# EAGLE design Androspeed (EAGLE 5.11)
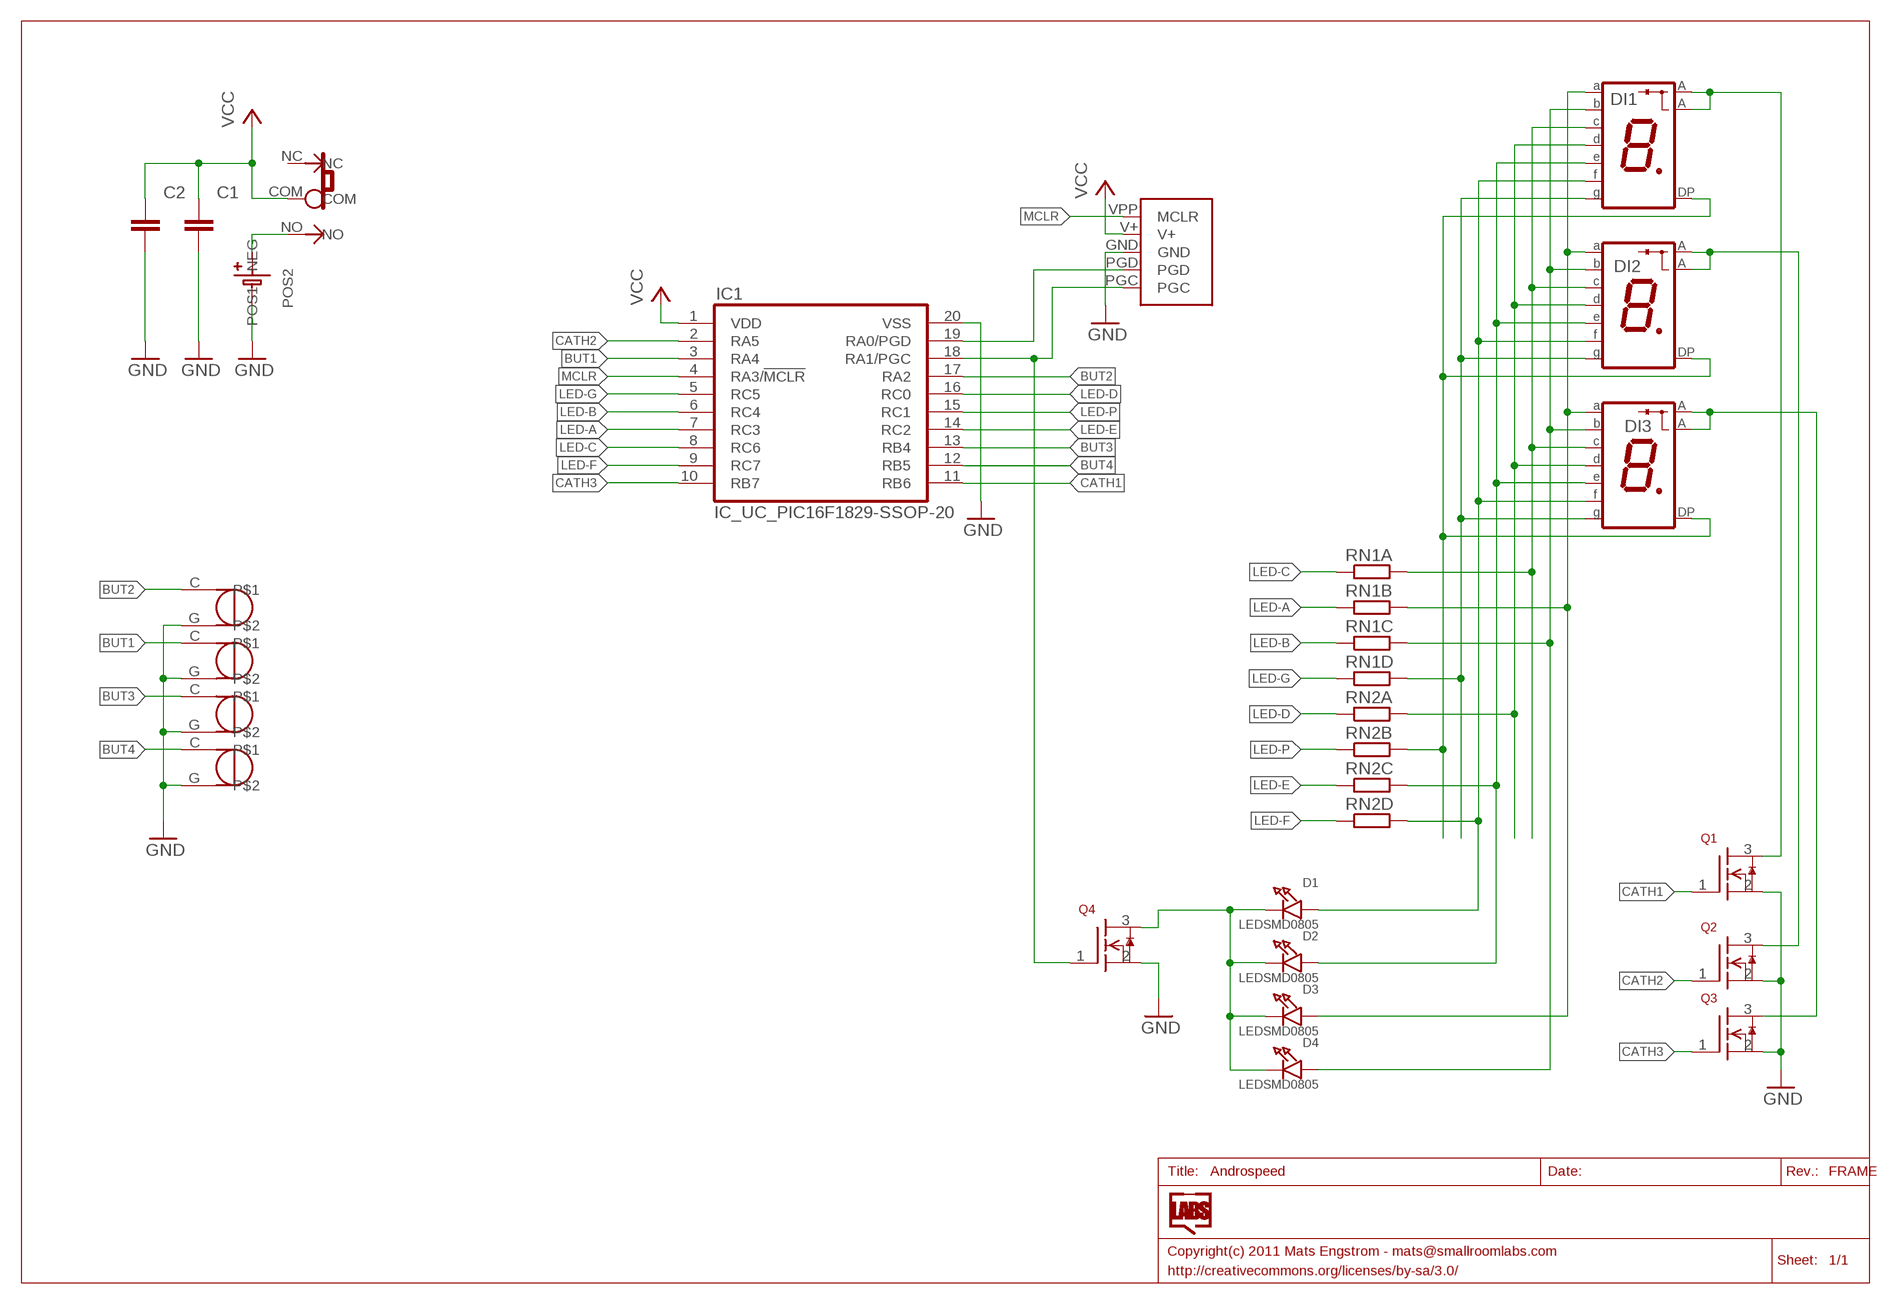
[diagram p0: schematic, sheet 1]

## Parts
B1  TOUCH2-5D1  [TOUCH-CAP-5D1]
B2  TOUCH2-5D1  [TOUCH-CAP-5D1]
B3  TOUCH2-5D1  [TOUCH-CAP-5D1]
B4  TOUCH2-5D1  [TOUCH-CAP-5D1]
C1  CAPACITOR_NPOL-0805  [C805]
C2  CAPACITOR_NPOL-1206  [C1206]
CN1  ICSPPAD  [ICSP-PAD]
D1  LEDSMD0805  [CHIPLED_0805]
D2  LEDSMD0805  [CHIPLED_0805]
D3  LEDSMD0805  [CHIPLED_0805]
D4  LEDSMD0805  [CHIPLED_0805]
DI1  7SEG-CA0.39  [LG3911]
DI2  7SEG-CA0.39  [LG3911]
DI3  7SEG-CA0.39  [LG3911]
IC1  IC_UC_PIC16F1829-SSOP-20  [SSOP-20]
Q1  N-MOSFET-STD  [SOT23]
Q2  N-MOSFET-STD  [SOT23]
Q3  N-MOSFET-STD  [SOT23]
Q4  N-MOSFET-STD  [SOT23]
RN1  RESISTOR_ARRAY_4  [RN8P-4R-CRA06S]
RN2  RESISTOR_ARRAY_4  [RN8P-4R-CRA06S]
SW1  SLIDESWITCH-PCM12  [PCM12]
U$3  BATTERY-SMALLPADS  [CR2032-PTH-CHEAP-SMALLPADS]

## Nets
ANODE-A: D3.A DI1.P$10(A) DI2.P$10(A) DI3.P$10(A) RN1.7
ANODE-B: D4.A DI1.P$9(B) DI2.P$9(B) DI3.P$9(B) RN1.6
ANODE-C: DI1.P$7(C) DI2.P$7(C) DI3.P$7(C) RN1.8
ANODE-D: DI1.P$5(D) DI2.P$5(D) DI3.P$5(D) RN2.8
ANODE-E: D2.A DI1.P$2(E) DI2.P$2(E) DI3.P$2(E) RN2.6
ANODE-F: D1.A DI1.P$1(F) DI2.P$1(F) DI3.P$1(F) RN2.5
ANODE-G: DI1.P$6(G) DI2.P$6(G) DI3.P$6(G) RN1.5
ANODE-P: DI1.P$4(DP) DI2.P$4(DP) DI3.P$4(DP) RN2.7
BUT1: B2.C IC1.3(RA4)
BUT2: B1.C IC1.17(RA2)
BUT3: B3.C IC1.13(RB4)
BUT4: B4.C IC1.12(RB5)
CATH1: IC1.11(RB6) Q1.1(G)
CATH2: IC1.2(RA5) Q2.1(G)
CATH3: IC1.10(RB7) Q3.1(G)
GND: B1.G B2.G B3.G B4.G C1.2 C2.2 CN1.GND IC1.20(VSS) Q1.2(S) Q2.2(S) Q3.2(S) Q4.2(S) U$3.NEG
LED-A: IC1.7(RC3) RN1.2
LED-B: IC1.6(RC4) RN1.3
LED-C: IC1.8(RC6) RN1.1
LED-D: IC1.16(RC0) RN2.1
LED-E: IC1.14(RC2) RN2.3
LED-F: IC1.9(RC7) RN2.4
LED-G: IC1.5(RC5) RN1.4
LED-P: IC1.15(RC1) RN2.2
MCLR: CN1.VPP(MCLR) IC1.4(RA3/!MCLR)
N$1: CN1.PGD IC1.19(RA0/PGD)
N$2: CN1.PGC IC1.18(RA1/PGC) Q4.1(G)
N$4: D1.C D2.C D3.C D4.C Q4.3(D)
N$7: SW1.NO U$3.POS@1(POS1)
N$17: DI3.P$3(A) DI3.P$8(A) Q3.3(D)
N$18: DI2.P$3(A) DI2.P$8(A) Q2.3(D)
N$19: DI1.P$3(A) DI1.P$8(A) Q1.3(D)
VCC: C1.1 C2.1 CN1.V+ IC1.1(VDD) SW1.COM
Unconnected: SW1.NC

## Power pins joined to a net without a drawn wire
POS2: U$3.POS@3(POS2)

## Library data of the parts
B1-B4 = SmallRoomLabs:TOUCH2
C1 C2 = dp_devices:CAPACITOR_NPOL: Non-Polarized capacitor in various packages
CN1 = SmallRoomLabs:ICSP
D1-D4 = SmallRoomLabs:LED
DI1-DI3 = SmallRoomLabs:7SEG-CA
IC1 = dp_devices:IC_UC_PIC16F1829
Q1-Q4 = SmallRoomLabs:N-MOSFET
RN1 RN2 = dp_devices:RESISTOR_ARRAY_4: 4 Resistor Array 0603
SW1 = SmallRoomLabs:SLIDESWITCH
U$3 = SmallRoomLabs:BATTERY: A23 Farnell/E14 908721

## Board
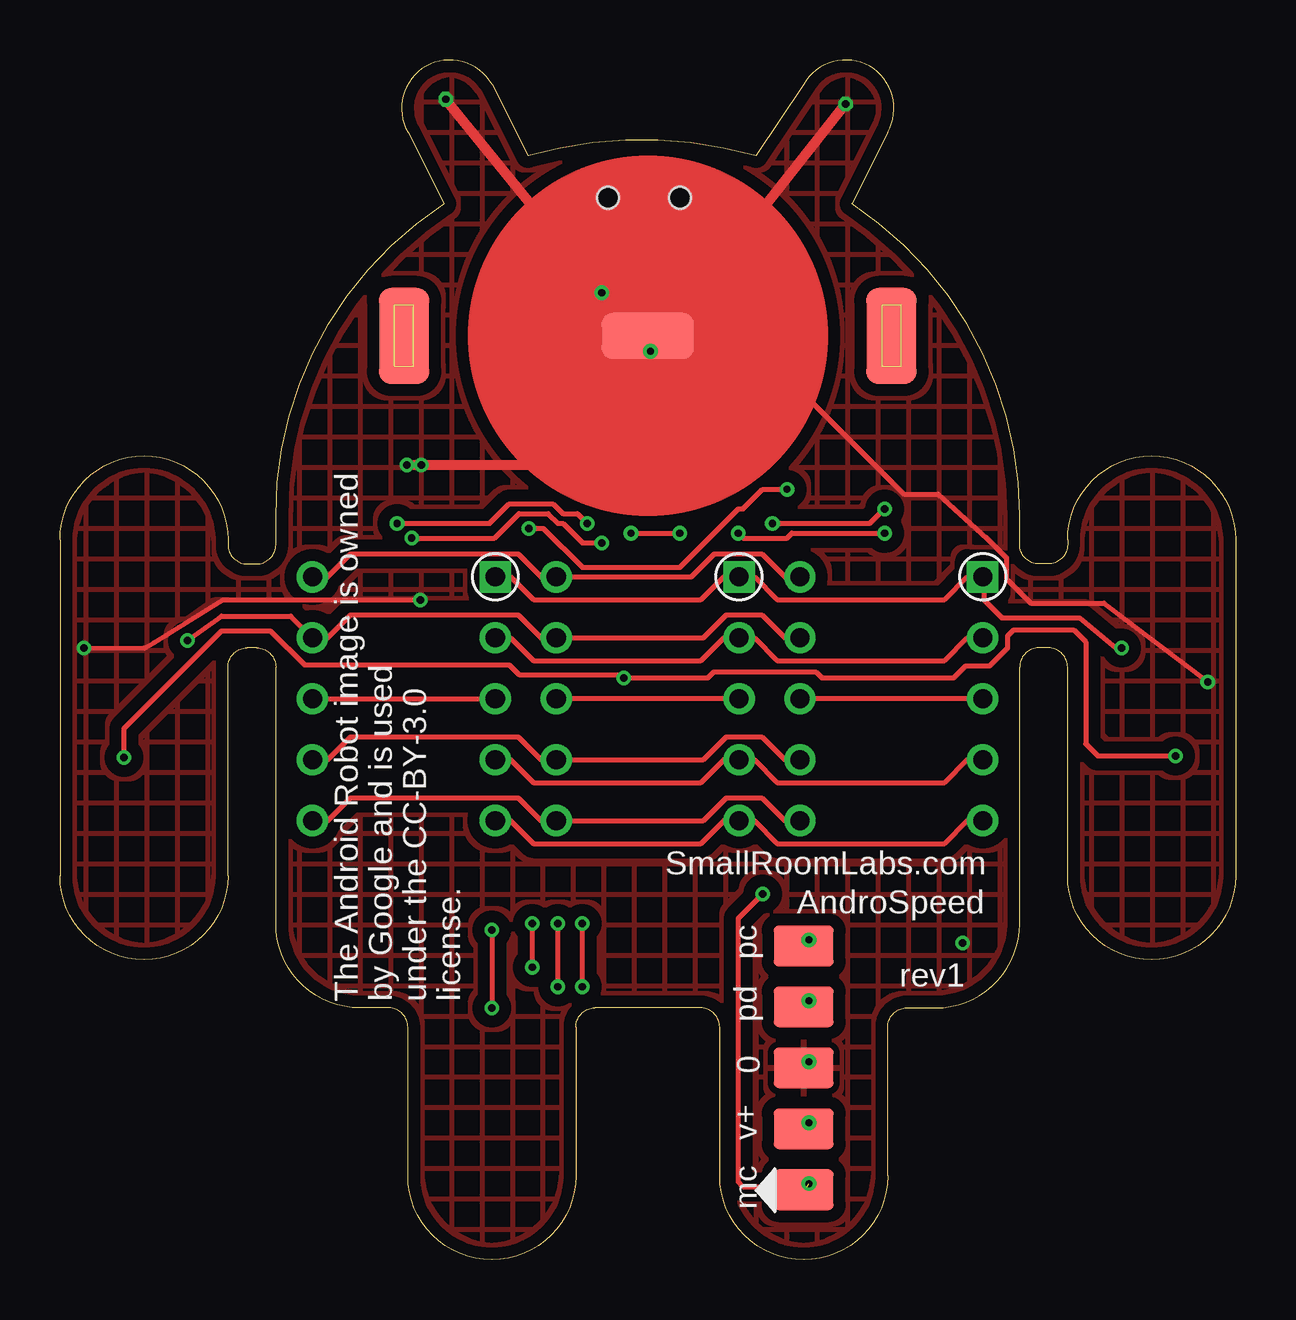
[diagram p1: board, top side]
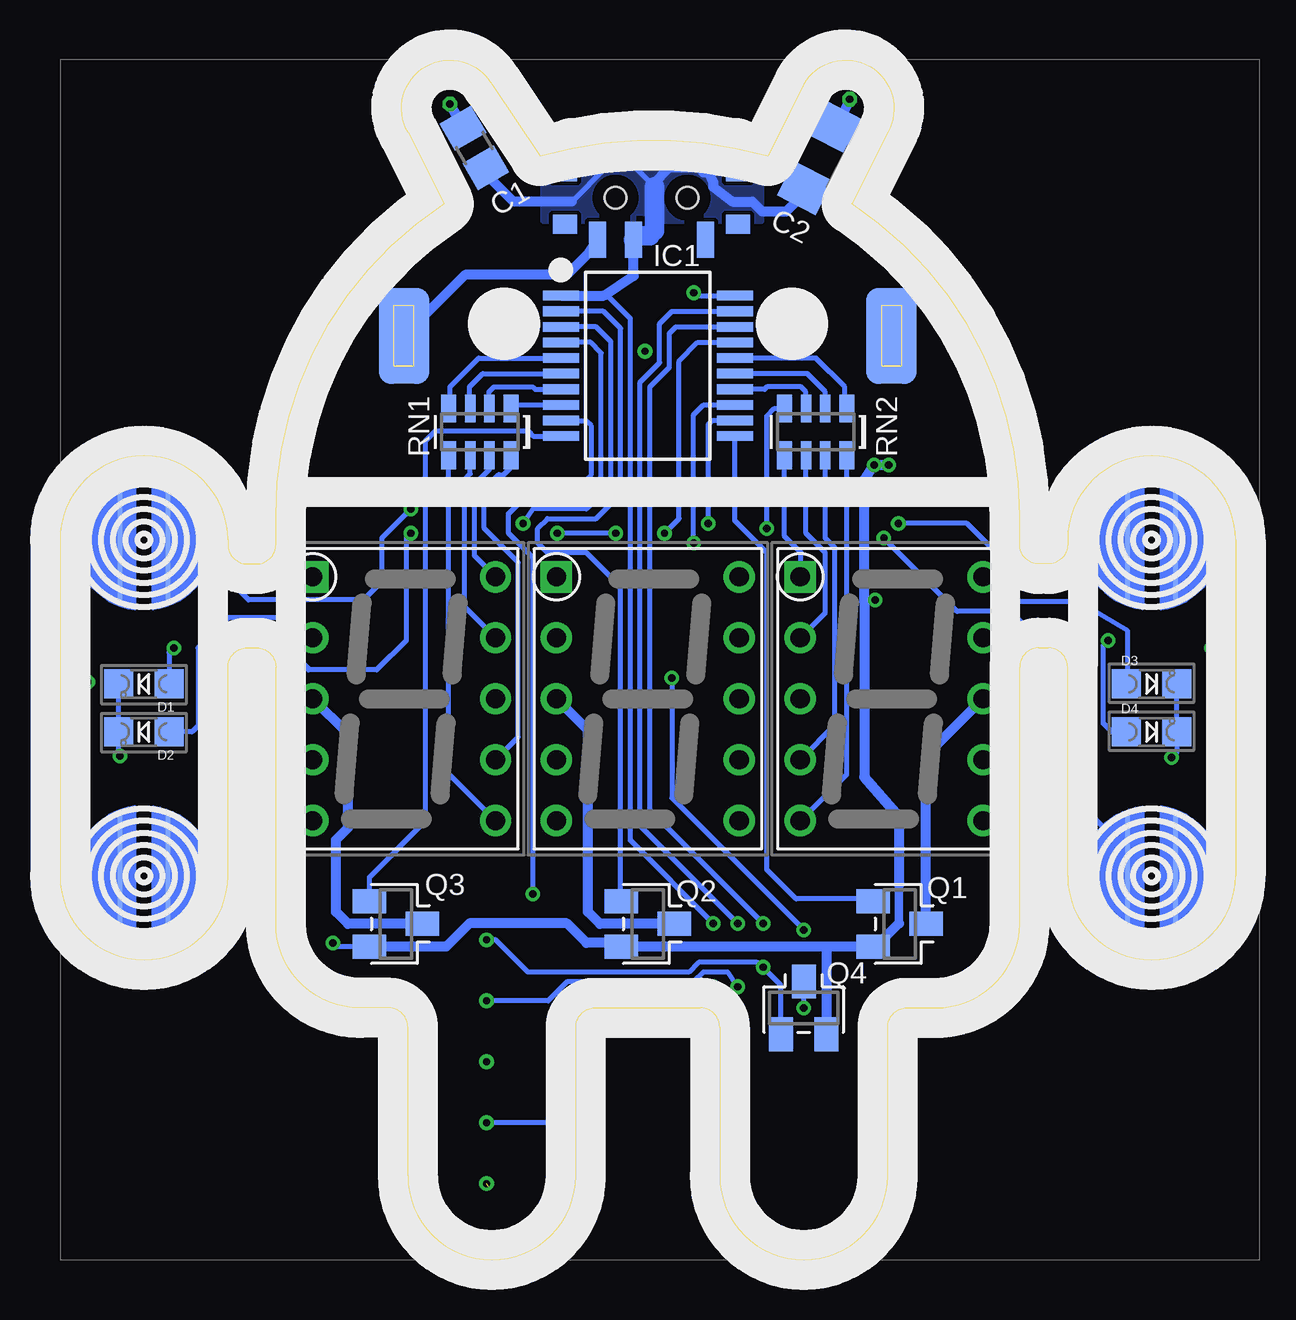
[diagram p2: board, bottom side, seen from below]

Size 49 x 49.99 mm. Coordinates in mm from the lower left corner, seen from the top.
Copper layers (1*16): Top 0.035mm / dielectric 1.5mm / Bottom 0.035mm
Design rules "SmartPrototyping": minimum track width 7mil, minimum drill 12mil, track to track 7mil, track to pad 7mil, pad to pad 7mil, via to via 7mil, smd to smd 0mil, copper to edge 20mil, drill to drill 10mil, minimum pad ring 10mil, minimum via ring 6mil, stop-mask expansion 2mil, vias tented up to drill 25mil, thermal gap 10mil

### Footprints (pad centres in the part's own frame; a part is rotated, then mirrored left to right if it is on the bottom)
TOUCH-CAP-5D1 = smd 0.203 x 5: C -1,0; G 1,0
C805 = smd 1.3 x 1.5: 1 -0.95,0; 2 0.95,0
C1206 = smd 1.6 x 1.803: 1 -1.422,0; 2 1.422,0
ICSP-PAD = smd 1.7 x 2.5: GND 0,0; PGC 5.08,0; PGD 2.54,0; V+ -2.54,0; VPP -5.08,0
CHIPLED_0805 = smd 1.2 x 1.2: A 0,-1.05; C 0,1.05
LG3911 = drill 0.8 square: P$1 -3.81,5.08 | drill 0.8 round: P$2 -3.81,2.54; P$3 -3.81,0; P$4 -3.81,-2.54; P$5 -3.81,-5.08; P$6 3.81,-5.08; P$7 3.81,-2.54; P$8 3.81,0; P$9 3.81,2.54; P$10 3.81,5.08
SSOP-20 = smd 0.4 x 1.5: 1 -2.925,-3.625; 2 -2.275,-3.625; 3 -1.625,-3.625; 4 -0.975,-3.625; 5 -0.325,-3.625; 6 0.325,-3.625; 7 0.975,-3.625; 8 1.625,-3.625; 9 2.275,-3.625; 10 2.925,-3.625; 11 2.925,3.625; 12 2.275,3.625; 13 1.625,3.625; 14 0.975,3.625; 15 0.325,3.625; 16 -0.325,3.625; 17 -0.975,3.625; 18 -1.625,3.625; 19 -2.275,3.625; 20 -2.925,3.625
SOT23 = smd 1 x 1.4: 1 -0.95,-1.1; 2 0.95,-1.1; 3 0,1.1
RN8P-4R-CRA06S = smd 0.63 x 1.15: 1 -1.295,-0.975; 4 1.295,-0.975; 5 1.295,0.975; 8 -1.295,0.975 | smd 0.44 x 1.15: 2 -0.4,-0.975; 3 0.4,-0.975; 6 0.4,0.975; 7 -0.4,0.975
PCM12 = smd 0.7 x 1.5: COM 0.75,1.75; NC -2.25,1.75; NO 2.25,1.75 | smd 1 x 0.8: P$1 -3.6,-1.1; P$2 -3.6,1.1; P$3 3.6,1.1; P$4 3.6,-1.1 | hole 0.9: -1.5,0; 1.5,0
CR2032-PTH-CHEAP-SMALLPADS = smd 3.81 x 1.905: NEG 0,0 | smd 2.1 x 4 bottom: POS@1 -10.16,0; POS@4 10.16,0 | smd 2.1 x 4: POS@2 -10.16,0; POS@3 10.16,0

### Placement (x,y rotation side)
B1  45.5,16 180 bottom
B2  45.5,30 180 bottom
B3  3.5,16 0 bottom
B4  3.5,30 0 bottom
C1  31.73,46.33 120 bottom
C2  17.3,45.92 63 bottom
CN1  31,8 90 top
D1  45.5,24 90 bottom
D2  45.5,22 90 bottom
D3  3.5,24 270 bottom
D4  3.5,22 270 bottom
DI1  14.34,23.38 0 bottom
DI2  24.5,23.38 0 bottom
DI3  34.66,23.38 0 bottom
IC1  24.5,37.25 270 bottom
Q1  14,14 270 bottom
Q2  24.5,14 270 bottom
Q3  35,14 270 bottom
Q4  18,10.5 0 bottom
RN1  31.5,34.5 180 bottom
RN2  17.5,34.5 180 bottom
SW1  24.34,44.25 180 bottom
U$2  [ANDROID_OUTLINE_5]  49,0 0 bottom
U$3  24.5,38.5 180 top

### Tracks (layer width: path | path; a pad name or v marks a point on that pad's centre or on a via)
ANODE-A
  Top 0.203: DI3.P$10 30.21,28.46 29.26,29.41 27.27,29.41 26.32,28.46 DI2.P$10 20.05,28.46 19.1,29.41 12.11,29.41 11.16,28.46 DI1.P$10
  Bottom 0.203: RN1.7 31.1,32.94 31.73,32.31 31.73,29.34 DI3.P$10 | DI1.P$10 10,28.46 8.97,27.43 6.53,27.43 4.5,26.21 4.5,24.05 D3.A
ANODE-B  (via drill 0.3)
  Top 0.203: DI3.P$9 30.21,25.92 29.26,26.87 27.77,26.87 26.82,25.92 DI2.P$9 20.05,25.92 19.1,26.87 12.11,26.87 11.16,25.92 DI1.P$9 9.62,26.82 6.73,26.82 v5.31,25.81
  Bottom 0.203: RN1.6 31.9,32.75 32.13,32.51 32.13,27.21 DI3.P$9 | D4.A 5.16,22 5.52,22.35 5.52,25.6 v5.31,25.81
ANODE-C
  Top 0.203: DI3.P$7 30.21,20.84 29.26,21.79 27.77,21.79 26.82,20.84 DI2.P$7 20.05,20.84 19.1,21.79 12.11,21.79 11.16,20.84 DI1.P$7
  Bottom 0.203: DI3.P$7 29.9,21.79 29.9,29.06 31.32,30.48 31.32,32.11 30.71,32.72 30.51,32.72 30.2,33.02 RN1.8
ANODE-D
  Top 0.203: DI3.P$5 37.83,18.3 36.88,17.35 29.89,17.35 28.94,18.3 DI2.P$5 27.67,18.3 26.72,17.35 19.73,17.35 18.78,18.3 DI1.P$5
  Bottom 0.203: RN2.8 16.2,20.24 DI1.P$5
ANODE-E
  Top 0.203: DI3.P$2 37.83,25.92 36.88,24.97 29.89,24.97 28.94,25.92 DI2.P$2 27.67,25.92 26.72,24.97 19.73,24.97 18.78,25.92 DI1.P$2
  Bottom 0.203: RN2.6 17.9,30.27 17.1,29.46 17.1,26.97 DI1.P$2 | D2.A 43.5,22 43.25,22.25 43.25,25.5 42,26.75 39.29,26.75 DI3.P$2
ANODE-F  (via drill 0.3)
  Top 0.203: DI1.P$1 18.78,28.46 19.73,27.51 26.72,27.51 27.67,28.46 DI2.P$1 28.94,28.46 29.89,27.51 36.88,27.51 37.83,28.46 DI3.P$1 38.5,28.43 38.5,27.5 39.25,26.75 42.5,26.75 44,25.5 v44.25,25.5
  Bottom 0.203: RN2.5 18.79,30.14 18.11,29.46 18.11,28.49 DI1.P$1 | D1.A 44.45,25.3 v44.25,25.5
ANODE-G
  Top 0.203: DI3.P$6 30.21,18.3 29.26,19.25 27.77,19.25 26.82,18.3 DI2.P$6 20.05,18.3 19.1,19.25 12.11,19.25 11.16,18.3 DI1.P$6
  Bottom 0.203: RN1.5 32.79,20.25 DI3.P$6
ANODE-P
  Top 0.203: DI3.P$4 37.83,20.84 36.88,19.89 29.89,19.89 28.94,20.84 DI2.P$4 27.67,20.84 26.72,19.89 19.73,19.89 18.78,20.84 DI1.P$4
  Bottom 0.203: RN2.7 17.1,30.08 16.69,29.67 16.69,22.29 DI1.P$4
BUT1  (via drill 0.3)
  Top 0.203: v29.7,30.68 33.76,30.68 v34.37,31.29
  Bottom 0.203: IC1.3 26.65,38.88 26.04,38.26 26.04,32.31 27.05,31.29 29.29,31.29 v29.7,30.68 | B2.C 43.64,30 41.14,27.5 36.33,27.5 35.59,28.25 35.59,30.07 v34.37,31.29
BUT2  (via drill 0.3)
  Top 0.203: v23.8,30.28 v25.84,30.28 | v34.37,30.28 30.51,30.28 30.31,30.07 28.48,30.07 v28.27,30.28
  Bottom 0.203: IC1.17 22.42,38.23 23.19,37.45 23.19,30.89 v23.8,30.28 | B1.C 42.75,18.25 42.75,25.26 41.76,26.25 40.25,26.25 38.64,24.64 38.64,24.59 35.79,24.59 34.57,25.81 34.57,30.07 v34.37,30.28 | v25.84,30.28 v28.27,30.28
BUT3  (via drill 0.3)
  Top 0.203: v14.66,30.07 18.11,30.07 19.13,31.09 20.35,31.09 20.76,30.68 20.96,30.68 21.77,29.87 v22.58,29.87
  Bottom 0.203: IC1.13 22.18,35.62 22.58,35.22 v22.58,29.87 | B3.C 4.5,17 6.25,18.75 6.25,25.73 6.73,26.21 8.56,26.21 9.38,27.03 11.61,27.03 v14.66,30.07
BUT4  (via drill 0.3)
  Top 0.203: v14.05,30.68 17.91,30.68 18.72,31.5 20.55,31.5 20.96,31.09 21.57,31.09 v21.97,30.68
  Bottom 0.203: IC1.12 21.81,34.98 21.97,34.81 v21.97,30.68 | B4.C 4.57,30 6.33,28.25 8.77,28.25 11.2,30.68 v14.05,30.68
CATH1
  Bottom 0.203: IC1.11 20.87,30.8 19.54,29.46 19.54,16.26 18.32,15.04 15.19,15.04 Q1.1
CATH2
  Bottom 0.203: IC1.2 26.35,39.52 25.63,38.81 25.63,31.9 26.65,30.89 28.68,30.89 29.09,30.48 29.09,29.87 28.68,29.46 27.05,29.46 25.63,28.04 25.63,14.98 Q2.1
CATH3
  Bottom 0.203: IC1.10 29.27,34.33 29.49,34.54 33.35,34.54 33.76,34.14 33.76,18.29 36.1,15.95 Q3.1
GND  (via drill 0.3)
  Top 0.203: v47.85,24.08 43.51,27.37 40.47,27.37 39.45,28.39 39.45,29.26 38.64,30.07 36.6,31.9 35.18,31.9 28.48,38.61 v24.62,37.86 U$3.NEG 22.91,40.09 v22.58,40.3 | v15.02,27.5 6.8,27.5 3.89,25.7 3.51,25.49 v1,25.5
  Top 0.406: v14.46,33.12 20.15,33.12 v24.62,37.86 | v24.62,37.86 v16.08,48.36 | v24.62,37.86 v32.74,48.16
  Bottom 0.203: B3.G 2.5,16.5 1,18 v1,25.5 1,28 B4.G | B1.G 46.5,16.5 48,18 48,24.18 | 48,24.18 48,28 B2.G | IC1.20 22.3,40.17 v22.58,40.3 | v47.85,24.08 48,24.18 | v15.02,27.5 15.4,27.5 15.47,27.43 | Q3.2 37.46,13.05 v37.62,13.21
  Bottom 0.356: 14.02,15.62 14.02,14.02
  Bottom 0.406: Q3.2 32.9,13.05 31.93,14.02 27.87,14.02 27.05,13.21 25.76,13.21 Q2.2 17,13.05 | 17,13.05 Q1.2 15.02,13.05 14.02,14.02 | v14.46,33.12 v15.07,33.12 15.47,32.51 15.47,27.43 15.47,20.12 14.02,18.47 14.02,15.62 | 32.2,47.01 C1.2 v32.74,48.16 | v16.08,48.36 C2.2 | Q4.2 17.05,13 17,13.05
  other vias: 31.22,8.26
  pour Top (isolate 0.5, hatched): 49,34 40,34 40,50 9,50 9,34 0,34 0,12 9,12 9,10 14,10 14,0 35,0 35,10 40,10 40,12 49,12
LED-A
  Bottom 0.203: IC1.7 29.19,36.27 29.29,36.37 30.92,36.37 31.12,36.17 31.12,35.49 RN1.2
LED-B
  Bottom 0.203: IC1.6 31.38,36.92 31.93,36.37 31.93,35.51 RN1.3
LED-C
  Bottom 0.203: IC1.8 30.06,35.62 RN1.1
LED-D
  Bottom 0.203: IC1.16 17.49,37.58 16.28,36.37 16.28,35.55 RN2.1
LED-E
  Bottom 0.203: IC1.14 19.63,36.27 19.54,36.37 18.11,36.37 17.91,36.17 17.91,35.48 RN2.3
LED-F  (via drill 0.3)
  Top 0.203: v30.31,32.11 29.29,32.11 28.48,31.29 28.27,31.29 25.84,28.85 21.77,28.85 20.15,30.48 v19.54,30.48
  Bottom 0.203: RN2.4 19.21,35.48 19.54,35.15 v19.54,30.48 | v30.31,32.11 27.46,32.11 26.85,32.72 26.85,34.75 27.05,34.95 28.1,34.95 IC1.9
LED-G
  Bottom 0.203: IC1.5 31.54,37.58 32.74,36.37 32.74,35.53 RN1.4
LED-P
  Bottom 0.203: IC1.15 17.85,36.92 17.1,36.17 RN2.2
MCLR  (via drill 0.3)  (1 unrouted)
  Top 0.203: 30.92,3.05 31.13,3.05 CN1.VPP 30.87,3.05 28.48,3.05 28.27,3.25 28.27,14.22 v29.29,15.24
  Bottom 0.203: IC1.4 26.87,38.23 26.44,37.8 26.44,32.51 27.26,31.7 29.7,31.7 30.31,31.09 30.31,30.28 29.29,29.26 v29.29,15.24
  other vias: 31.22,3.17
N$1  (via drill 0.3)
  Top 0.203: v20.76,11.38 v20.76,14.02 | v31.22,10.79 31.03,10.57 CN1.PGD
  Bottom 0.203: IC1.19 23.5,39.52 24.01,39.01 24.01,37.39 24.82,36.58 24.82,18.09 v20.76,14.02 | v20.76,11.38 21.16,11.99 22.18,11.99 22.58,11.58 27.87,11.58 28.65,10.79 v31.22,10.79
N$2  (via drill 0.3)
  Top 0.203: v19.69,12.19 v19.69,14.02 | v31.22,13.34 30.75,13.46 CN1.PGC
  Bottom 0.203: IC1.18 23.33,38.88 23.6,38.61 23.6,37.19 24.41,36.37 24.41,18.74 v19.69,14.02 | v31.22,13.34 30.84,13.34 29.49,11.99 22.79,11.99 22.38,12.39 19.94,12.39 19.74,12.19 v19.69,12.19 18.95,11.45 Q4.1
N$4  (via drill 0.3)
  Top 0.203: v46.5,21 43.25,21 42.75,21.5 42.75,25.75 42.25,26.25 39.75,26.25 39.5,26 39.5,25.5 38.75,24.75 37.75,24.75 37.25,24.25 31.75,24.25 31.5,24.5 27.25,24.5 27,24.25 v23.5,24.25 23.5,24.28 23.4,24.38 19.13,24.38 18.72,24.79 10.19,24.79 8.77,26.21 6.73,26.21 2.67,22.15 v2.67,20.93 | v18,13.75 v18,10.5
  Bottom 0.203: D3.C D4.C 2.45,21.15 v2.67,20.93 | D1.C D2.C 46.55,21.05 v46.5,21 | v23.5,24.25 23.5,19.25 v18,13.75 | v18,10.5 Q4.3
N$7
  Bottom 0.406: SW1.NO 27,41.91 27.87,41.05 32.11,41.05 U$3.POS@1
N$17
  Top 0.203: DI3.P$3 DI3.P$8
  Bottom 0.406: Q3.3 37,14 37.5,14.5 37.5,17.5 37,18 37,21.91 DI3.P$3
N$18
  Top 0.203: DI2.P$3 DI2.P$8
  Bottom 0.406: Q2.3 26.5,14 27,14.5 27,22.07 DI2.P$3
N$19
  Top 0.203: DI1.P$8 DI1.P$3
  Bottom 0.406: Q1.3 12.9,21 DI1.P$8
VCC  (via drill 0.3)
  Top 0.203: v21.77,11.38 v21.77,14.02 | v31.22,5.71 31.03,5.49 CN1.V+
  Bottom 0.203: 31.25,45.24 31.25,45.45 | 27.66,44.09 26.24,45.52 25.02,45.52 24.31,44.81 24.21,44.7 | 24.41,42.67 24.21,42.88 | IC1.1 26.18,40.17 25.23,39.22 25.23,17.48 v21.77,14.02 | v21.77,11.38 21.97,11.18 27.46,11.18 28.27,10.36 28.27,6.12 28.68,5.71 v31.22,5.71
  Bottom 0.406: IC1.1 26.32,40.17 25.09,41 SW1.COM 25.02,42.57 | 31.25,45.45 C1.1 | 31.25,45.24 30.1,44.09 27.66,44.09 | C2.1 17.95,44.47 18.72,43.69 19.74,43.69 20.15,44.09 20.96,44.09 21.77,44.7 21.77,44.91 21.97,45.31 22.18,45.31 22.38,45.52 23.6,45.52 24.31,44.81
  Bottom 0.813: 24.21,42.88 24.21,44.7 | 24.41,42.67 24.92,42.67 SW1.COM
  pour Bottom: 28.88,43.28 19.74,43.28 19.74,46.13 28.88,46.13

### Text on the board
tPlace: SmallRoomLabs.com | AndroSpeed | The Android Robot image is owned | by Google and is used | under the CC-BY-3.0 | license. | rev1